# EAGLE design STM32L15x_Test (EAGLE 7.5.0)
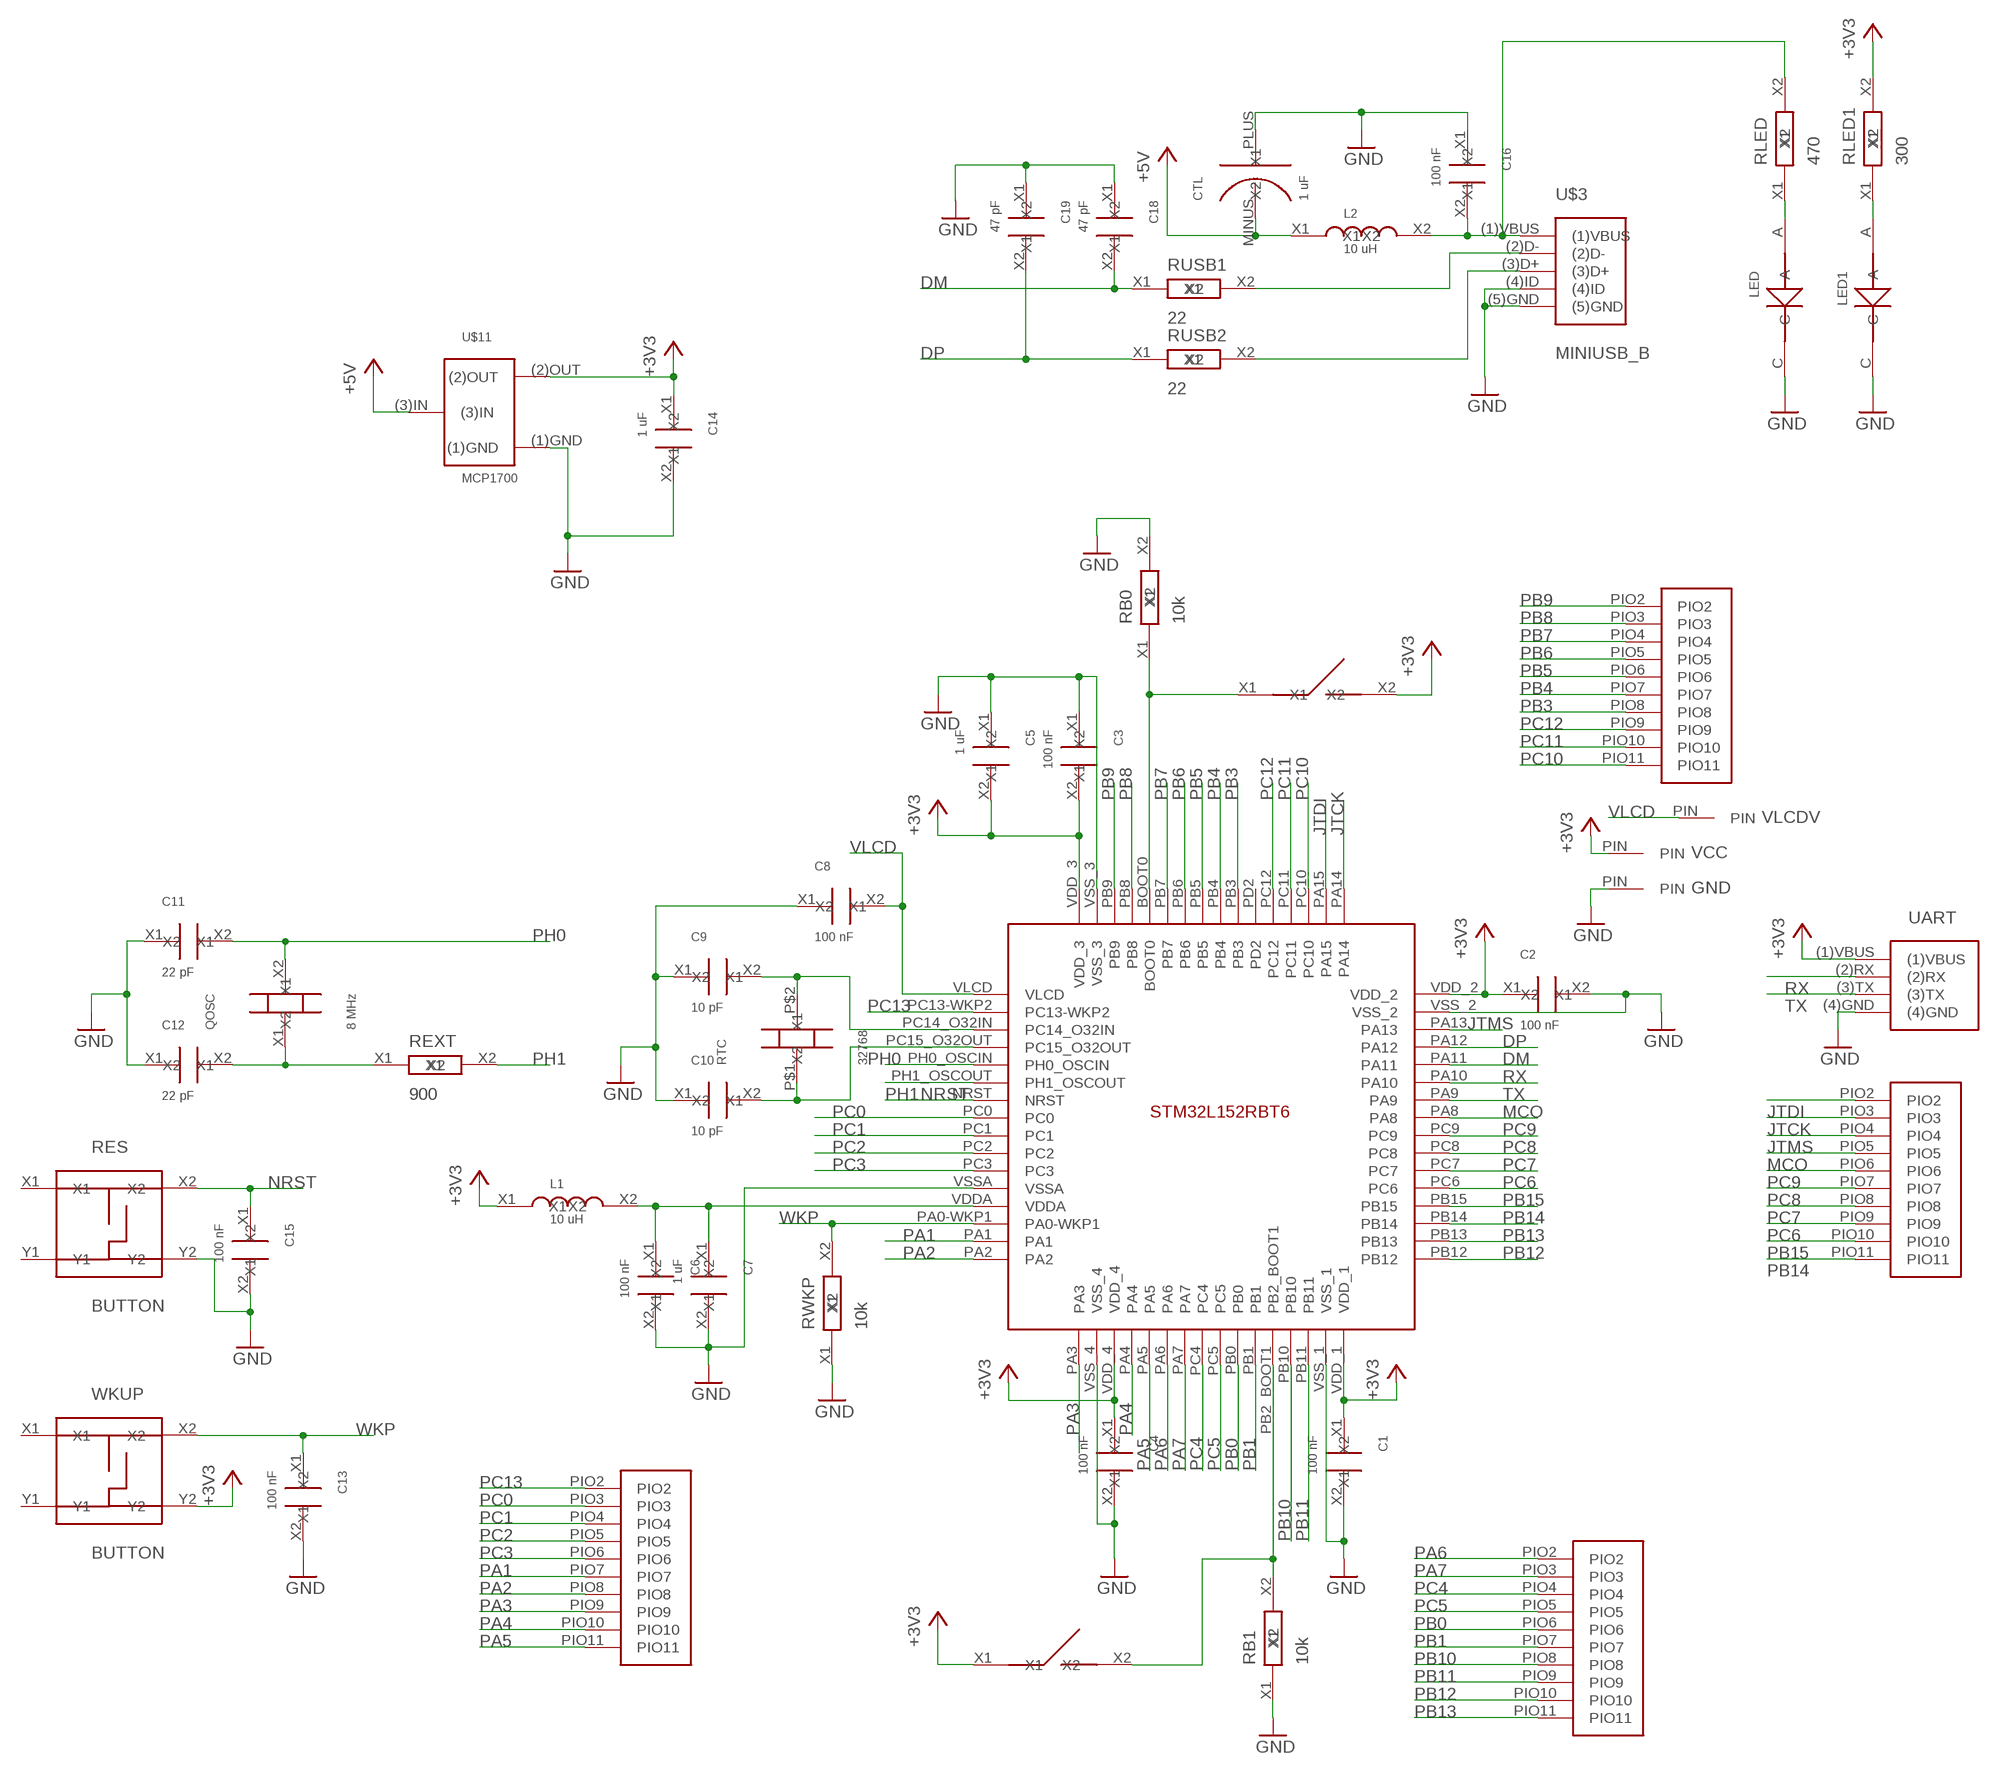
[diagram p0: schematic, sheet 1]

## Parts
C1  100 nF  C_SMD_2.1X1.25  [SMD_2.1X1.25]
C2  100 nF  C_SMD_2.1X1.25  [SMD_2.1X1.25]
C3  100 nF  C_SMD_2.1X1.25  [SMD_2.1X1.25]
C4  100 nF  C_SMD_2.1X1.25  [SMD_2.1X1.25]
C5  1 uF  C_SMD_2.1X1.25  [SMD_2.1X1.25]
C6  100 nF  C_SMD_2.1X1.25  [SMD_2.1X1.25]
C7  1 uF  C_SMD_2.1X1.25  [SMD_2.1X1.25]
C8  100 nF  C_SMD_2.1X1.25  [SMD_2.1X1.25]
C9  10 pF  C_SMD_2.1X1.25  [SMD_2.1X1.25]
C10  10 pF  C_SMD_2.1X1.25  [SMD_2.1X1.25]
C11  22 pF  C_SMD_2.1X1.25  [SMD_2.1X1.25]
C12  22 pF  C_SMD_2.1X1.25  [SMD_2.1X1.25]
C13  100 nF  C_SMD_2.1X1.25  [SMD_2.1X1.25]
C14  1 uF  C_SMD_2.1X1.25  [SMD_2.1X1.25]
C15  100 nF  C_SMD_2.1X1.25  [SMD_2.1X1.25]
C16  100 nF  C_SMD_2.1X1.25  [SMD_2.1X1.25]
C18  47 pF  C_SMD_2.1X1.25  [SMD_2.1X1.25]
C19  47 pF  C_SMD_2.1X1.25  [SMD_2.1X1.25]
CTL  1 uF  C_SMD_TA_A  [C_SMD_TA_A]
GND  PIN  [PIN]
L1  10 uH  L_SMD_2.1X1.25  [SMD_2.1X1.25]
L2  10 uH  L_SMD_2.1X1.25  [SMD_2.1X1.25]
LED  LED0805  [SMD0805]
LED1  LED0805  [SMD0805]
QOSC  8 MHz  QUARTZ_SMD  [QUARTZ_SMD]
RB0  10k  R_SMD_2.1X1.25  [SMD_2.1X1.25]
RB1  10k  R_SMD_2.1X1.25  [SMD_2.1X1.25]
RES  BUTTON  [BUTTON]
REXT  900  R_SMD_2.1X1.25  [SMD_2.1X1.25]
RLED  470  R_SMD_2.1X1.25  [SMD_2.1X1.25]
RLED1  300  R_SMD_2.1X1.25  [SMD_2.1X1.25]
RTC  32768  QUARTZ_CYL  [QUARTZ_CYL]
RUSB1  22  R_SMD_2.1X1.25  [SMD_2.1X1.25]
RUSB2  22  R_SMD_2.1X1.25  [SMD_2.1X1.25]
RWKP  10k  R_SMD_2.1X1.25  [SMD_2.1X1.25]
U$1  STM32L15XRBT6  [STM32L152RBT6]
U$2  PIO_10  [PIO_10]
U$3  MINIUSB_B  [MINIUSB_B]
U$5  PIO_10  [PIO_10]
U$6  PIO_10  [PIO_10]
U$7  PIO_10  [PIO_10]
U$8  DIP_1  [DIP_1]
U$9  DIP_1  [DIP_1]
U$11  MCP1700  [MCP1700]
UART  USART  [USART]
VCC  PIN  [PIN]
VLCDV  PIN  [PIN]
WKUP  BUTTON  [BUTTON]

## Nets
+3V3: C1.X1 C2.X1 C3.X2 C4.X1 C5.X2 C14.X1 L1.X1 RLED1.X2 U$1.VDD_1 U$1.VDD_2 U$1.VDD_3 U$1.VDD_4 U$8.X2 U$9.X1 U$11.(2)OUT UART.(1)VBUS VCC.PIN WKUP.Y2
+5V: CTL.MINUS(X1) L2.X1 U$11.(3)IN
BOOT0: RB0.X1 U$1.BOOT0 U$8.X1
BOOT1: RB1.X2 U$1.PB2_BOOT1 U$9.X2
DM: C18.X2 RUSB1.X1 U$1.PA11
DP: C19.X2 RUSB2.X1 U$1.PA12
GND: C1.X2 C2.X2 C3.X1 C4.X2 C5.X1 C6.X2 C7.X2 C8.X1 C9.X1 C10.X1 C11.X1 C12.X1 C13.X2 C14.X2 C15.X2 C16.X1 C18.X1 C19.X1 CTL.PLUS(X2) GND.PIN LED1.C LED.C RB0.X2 RB1.X1 RES.Y2 RWKP.X1 U$1.VSS_1 U$1.VSS_2 U$1.VSS_3 U$1.VSS_4 U$1.VSSA U$3.(4)ID U$3.(5)GND U$11.(1)GND UART.(4)GND
JTCK: U$1.PA14 U$6.PIO3
JTDI: U$1.PA15 U$6.PIO2
JTMS: U$1.PA13 U$6.PIO4
MCO: U$1.PA8 U$6.PIO5
N$1: C6.X1 C7.X1 L1.X2 U$1.VDDA
N$2: C9.X2 RTC.P$2(X2) U$1.PC14_O32IN
N$3: C10.X2 RTC.P$1(X1) U$1.PC15_O32OUT
N$6: C12.X2 QOSC.X1 REXT.X1
N$7: C16.X2 L2.X2 RLED.X2 U$3.(1)VBUS
N$8: RUSB1.X2 U$3.(2)D-
N$9: RUSB2.X2 U$3.(3)D+
N$10: LED.A RLED.X1
N$11: LED1.A RLED1.X1
NRST: C15.X1 RES.X2 U$1.NRST
PA1: U$1.PA1 U$2.PIO7
PA2: U$1.PA2 U$2.PIO8
PA3: U$1.PA3 U$2.PIO9
PA4: U$1.PA4 U$2.PIO10
PA5: U$1.PA5 U$2.PIO11
PA6: U$1.PA6 U$5.PIO2
PA7: U$1.PA7 U$5.PIO3
PB0: U$1.PB0 U$5.PIO6
PB1: U$1.PB1 U$5.PIO7
PB3: U$1.PB3 U$7.PIO8
PB4: U$1.PB4 U$7.PIO7
PB5: U$1.PB5 U$7.PIO6
PB6: U$1.PB6 U$7.PIO5
PB7: U$1.PB7 U$7.PIO4
PB8: U$1.PB8 U$7.PIO3
PB9: U$1.PB9 U$7.PIO2
PB10: U$1.PB10 U$5.PIO8
PB11: U$1.PB11 U$5.PIO9
PB12: U$1.PB12 U$5.PIO10
PB13: U$1.PB13 U$5.PIO11
PB14: U$1.PB14 U$6.PIO11
PB15: U$1.PB15 U$6.PIO10
PC0: U$1.PC0 U$2.PIO3
PC1: U$1.PC1 U$2.PIO4
PC2: U$1.PC2 U$2.PIO5
PC3: U$1.PC3 U$2.PIO6
PC4: U$1.PC4 U$5.PIO4
PC5: U$1.PC5 U$5.PIO5
PC6: U$1.PC6 U$6.PIO9
PC7: U$1.PC7 U$6.PIO8
PC8: U$1.PC8 U$6.PIO7
PC9: U$1.PC9 U$6.PIO6
PC10: U$1.PC10 U$7.PIO11
PC11: U$1.PC11 U$7.PIO10
PC12: U$1.PC12 U$7.PIO9
PC13: U$1.PC13-WKP2 U$2.PIO2
PH0: C11.X2 QOSC.X2 U$1.PH0_OSCIN
PH1: REXT.X2 U$1.PH1_OSCOUT
RX: U$1.PA10 UART.(2)RX
TX: U$1.PA9 UART.(3)TX
VLCD: C8.X2 U$1.VLCD VLCDV.PIN
WKP: C13.X1 RWKP.X2 U$1.PA0-WKP1 WKUP.X2
Unconnected: RES.X1 RES.Y1 U$1.PD2 WKUP.X1 WKUP.Y1

## Library data of the parts
C1-C16 C18 C19 = MyPowerComponents:C_SMD_2.1X1.25
CTL = MyAmSys:C_SMD_TA_A
GND VCC VLCDV = MySTM32F103RGT6:PIN
L1 L2 = MyPowerComponents:L_SMD_2.1X1.25
LED LED1 = My_BLE:LED0805
QOSC = MySTM32F103RGT6:QUARTZ_SMD
RB0 RB1 REXT RLED RLED1 RUSB1 RUSB2 RWKP = MyPowerComponents:R_SMD_2.1X1.25
RES WKUP = My_STM32:BUTTON
RTC = MySTM32F103RGT6:QUARTZ_CYL
U$1 = My_STM32L15x:STM32L15XRBT6
U$2 U$5-U$7 = My_BLE:PIO_10
U$3 = MyCMOSsensor:MINIUSB_B
U$8 U$9 = My_STM32L15x:DIP_1
U$11 = MyCMOSsensor:MCP1700
UART = MyCMOSsensor:USART

## Board
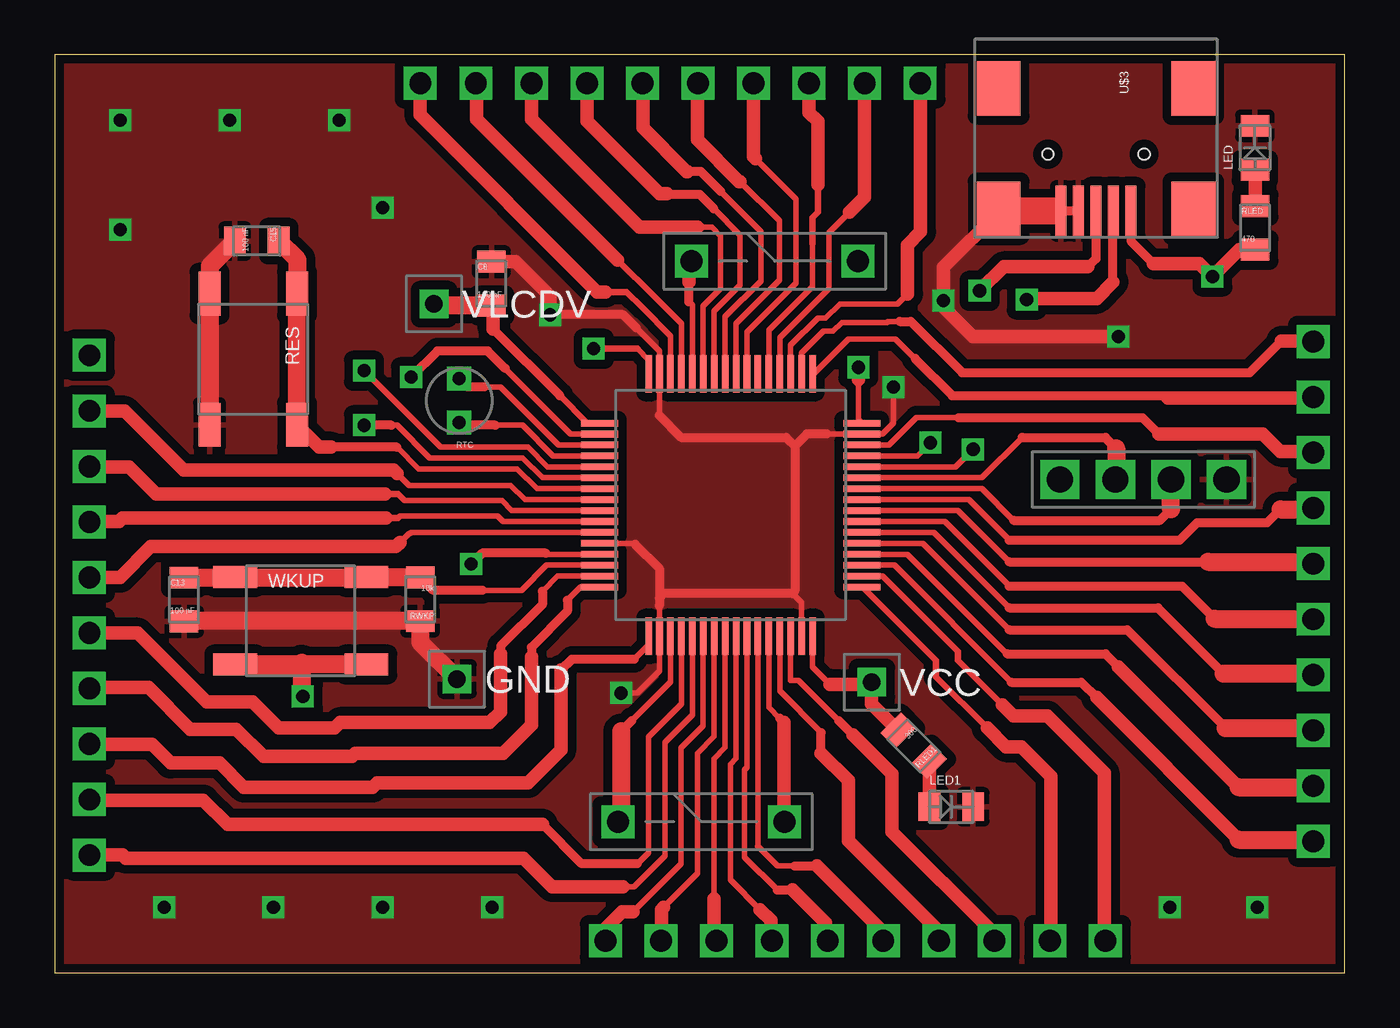
[diagram p1: board, top side]
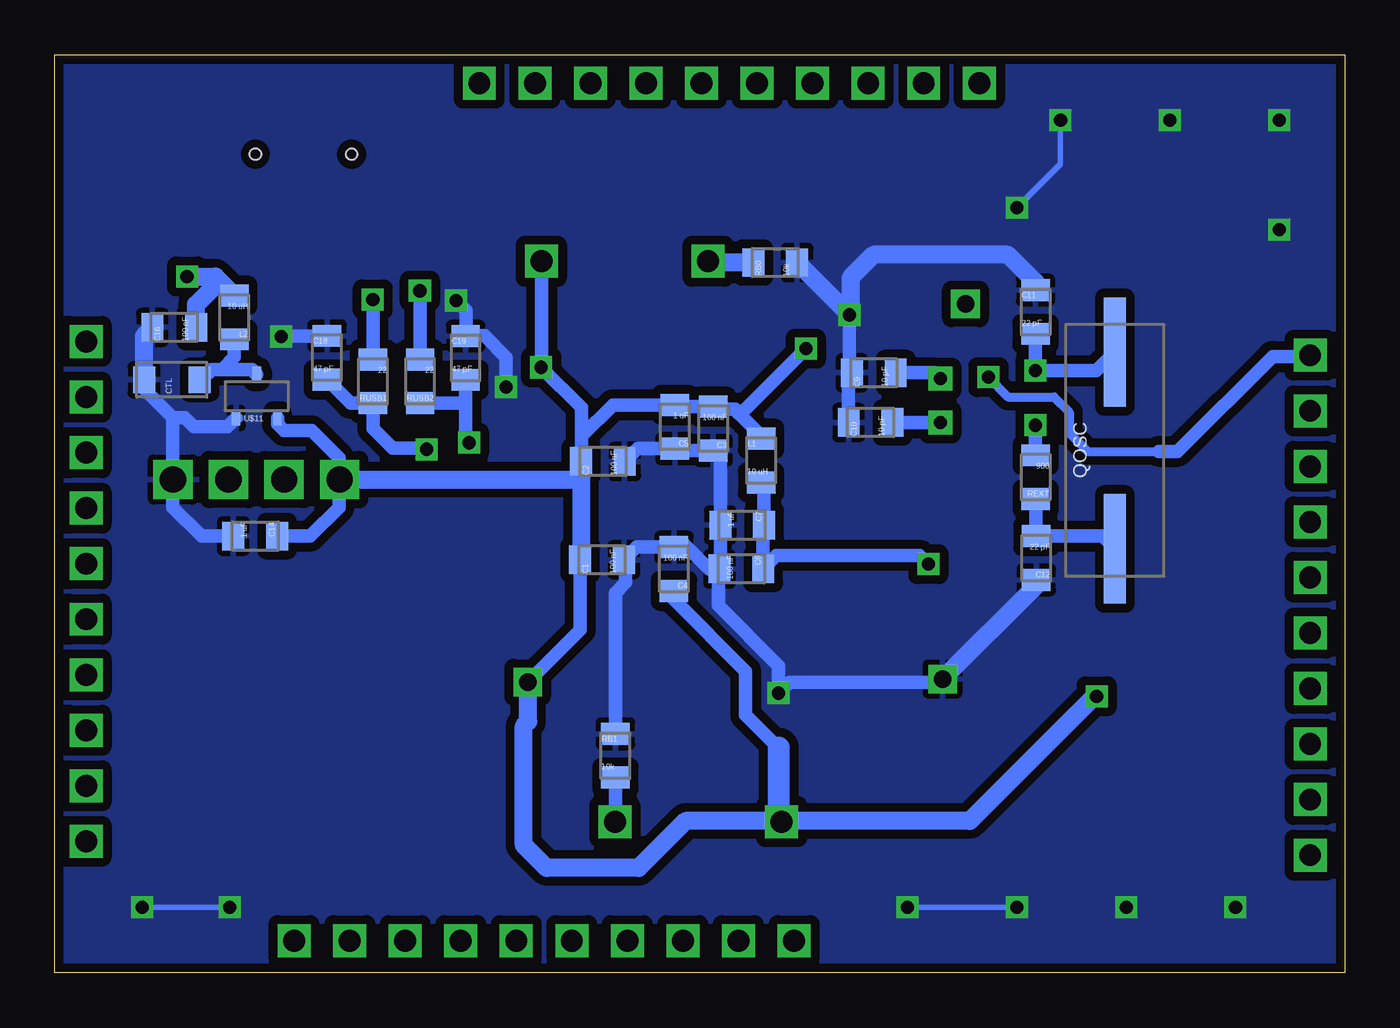
[diagram p2: board, bottom side, seen from below]

Size 59 x 42 mm. Coordinates in mm from the lower left corner, seen from the top.
Outline: 0,0 59,0 59,42 0,42 0,0
Copper layers (1*16): Top 0.035mm / dielectric 1.5mm / Bottom 0.035mm
Design rules "default *": minimum track width 10mil, minimum drill 24mil, track to track 8mil, track to pad 8mil, pad to pad 8mil, via to via 8mil, smd to smd 8mil, copper to edge 10mil, drill to drill 8mil, minimum pad ring 10mil, minimum via ring 8mil, stop-mask expansion 4mil, vias tented up to drill 0mil, thermal gap 10mil

### Footprints (pad centres in the part's own frame; a part is rotated, then mirrored left to right if it is on the bottom)
SMD_2.1X1.25 = smd 1.3 x 1: X1 0,1; X2 0,-1
C_SMD_TA_A = smd 1.2 x 1: MINUS 0,-1.27; PLUS 0,1.27
PIN = drill 0.8 square: PIN 0,0
SMD0805 = smd 1 x 1.3: A -1,0; C 1,0
QUARTZ_SMD = smd 5 x 1: X1 -4.5,0; X2 4.5,0
BUTTON = smd 2 x 1: X1 -3,2; X2 3,2; Y1 -3,-2; Y2 3,-2
QUARTZ_CYL = drill 0.6 square: P$1 0,1; P$2 0,-1
STM32L152RBT6 = smd 0.3 x 1.7: BOOT0 -1.75,6; PA3 -3.75,-6; PA4 -2.25,-6; PA5 -1.75,-6; PA6 -1.25,-6; PA7 -0.75,-6; PA14 3.75,6; PA15 3.25,6; PB0 0.75,-6; PB1 1.25,-6; PB2_BOOT1 1.75,-6; PB3 0.75,6; PB4 0.25,6; PB5 -0.25,6; PB6 -0.75,6; PB7 -1.25,6; PB8 -2.25,6; PB9 -2.75,6; PB10 2.25,-6; PB11 2.75,-6; PC4 -0.25,-6; PC5 0.25,-6; PC10 2.75,6; PC11 2.25,6; PC12 1.75,6; PD2 1.25,6; VDD_1 3.75,-6; VDD_3 -3.75,6; VDD_4 -2.75,-6; VSS_1 3.25,-6; VSS_3 -3.25,6; VSS_4 -3.25,-6 | smd 1.7 x 0.3: NRST -6,0.75; PA0-WKP1 -6,-2.75; PA1 -6,-3.25; PA2 -6,-3.75; PA8 6,0.25; PA9 6,0.75; PA10 6,1.25; PA11 6,1.75; PA12 6,2.25; PA13 6,2.75; PB12 6,-3.75; PB13 6,-3.25; PB14 6,-2.75; PB15 6,-2.25; PC0 -6,0.25; PC1 -6,-0.25; PC2 -6,-0.75; PC3 -6,-1.25; PC6 6,-1.75; PC7 6,-1.25; PC8 6,-0.75; PC9 6,-0.25; PC13-WKP2 -6,3.25; PC14_O32IN -6,2.75; PC15_O32OUT -6,2.25; PH0_OSCIN -6,1.75; PH1_OSCOUT -6,1.25; VDD_2 6,3.75; VDDA -6,-2.25; VLCD -6,3.75; VSS_2 6,3.25; VSSA -6,-1.75
PIO_10 = drill 1 square: PIO2 0,12.7; PIO3 0,10.16; PIO4 0,7.62; PIO5 0,5.08; PIO6 0,2.54; PIO7 0,0; PIO8 0,-2.54; PIO9 0,-5.08; PIO10 0,-7.62; PIO11 0,-10.16
MINIUSB_B = smd 2.3 x 0.5: (1)VBUS 0,1.6; (2)D- 0,0.8; (3)D+ 0,0; (4)ID 0,-0.8; (5)GND 0,-1.6 | smd 2.5 x 2: PG1 -0.1,-4.45; PG2 -5.6,-4.45; PG3 -5.6,4.45; PG4 -0.1,4.45 | hole 0.5: -2.6,2.2; -2.6,-2.2
DIP_1 = drill 1 square: X1 0,2.54; X2 0,-5.08
MCP1700 = smd 0.4 x 0.7: (1)GND -0.95,-2; (2)OUT 0.95,-2; (3)IN 0,0
USART = drill 1.2 square: (1)VBUS 0,5.08; (2)RX 0,2.54; (3)TX 0,0; (4)GND 0,-2.54

### Placement (x,y rotation side)
C1  33.97,18.9 90 bottom
C2  33.93,23.4 90 bottom
C3  28.89,24.9 180 bottom
C4  30.68,18.48 180 bottom
C5  30.64,24.98 180 bottom
C6  27.6,18.48 270 bottom
C7  27.56,20.48 270 bottom
C8  19.97,31.53 0 top
C9  21.54,27.45 90 bottom
C10  21.69,25.18 90 bottom
C11  14.15,30.23 0 bottom
C12  14.11,18.98 180 bottom
C13  5.92,17.08 0 top
C14  49.83,19.98 270 bottom
C15  9.24,33.48 270 top
C16  53.53,29.53 90 bottom
C18  46.55,28.14 0 bottom
C19  40.21,28.13 0 bottom
CTL  53.64,27.13 90 bottom
GND  18.4,13.44 0 top
L1  26.69,23.44 0 bottom
L2  50.79,29.98 180 bottom
LED  54.89,37.74 90 top
LED1  41,7.6 0 top
QOSC  10.52,23.9 90 bottom
RB0  26.05,32.49 90 bottom
RB1  33.36,9.94 0 bottom
RES  9.08,28.07 270 top
REXT  14.14,22.68 180 bottom
RLED  54.9,34.08 0 top
RLED1  39.29,10.39 225 top
RTC  18.5,26.18 180 top
RUSB1  44.44,27.06 180 bottom
RUSB2  42.29,27.06 180 bottom
RWKP  16.72,17.09 180 top
U$1  30.91,21.4 0 top
U$2  1.59,15.55 0 top
U$3  47.62,34.85 270 top
U$5  37.89,1.48 90 top
U$6  57.56,16.18 0 top
U$7  29.42,40.7 90 top
U$8  31.66,32.55 90 top
U$9  28.3,6.92 90 top
U$11  49.76,27.38 0 bottom
UART  51.05,22.57 90 top
VCC  37.37,13.3 0 top
VLCDV  17.35,30.6 0 top
WKUP  11.25,16.11 0 top

### Tracks (layer width: path | path; a pad name or v marks a point on that pad's centre or on a via)
+3V3  (via drill 0.6)
  Top 0.254: U$1.VDD_3 27.16,28.04 26.65,28.55 | U$1.VDD_4 28.16,13.31 26.4,11.55 | U$1.VDD_1 34.66,13.99 35.45,13.2 | 36.75,27.15 36.75,25.31 U$1.VDD_2
  Top 0.305: 26.65,28.55 v24.65,28.55
  Top 0.406: 26.4,11.55 25.9,11.05
  Top 0.61: 35.45,13.2 37.27,13.2 VCC.PIN 37.35,13.28 37.35,12.3 38.55,11.1 RLED1.X2 | v36.75,27.7 36.75,27.15
  Top 0.813: 25.9,11.05 25.9,7.06 U$9.X1 | WKUP.Y2 8.01,14.11 8,14.1 11.2,14.1 11.3,14.2 11.3,12.7 v11.35,12.65
  Bottom 0.254: 30.68,17.08 27.35,13.75 27.35,11.75 27.4,11.7 25.85,10.15 25.85,6.95
  Bottom 0.61: L1.X1 26.69,24.59 27.65,25.55 | 27.65,25.55 27.9,25.8 28.79,25.8 C3.X2 30.56,25.9 C5.X2 33.47,25.98 34.9,24.55 | v24.65,28.55 27.65,25.55 | 34.9,24.55 34.9,23.43 C2.X1 | C4.X1 30.68,17.08 27.4,13.8 27.4,11.8 25.9,10.3 | C1.X1 34.97,15.7 VCC.PIN | U$8.X2 v36.74,27.71 v36.75,27.7 34.9,25.85 34.9,24.55 | C14.X1 47.32,19.98 46,21.3 46,22.54 UART.(1)VBUS 46,22.6 46,23.55 47.25,24.8 48.5,24.8 48.81,25.11 U$11.(2)OUT
  Bottom 0.813: C2.X1 34.93,22.5 | 34.93,22.5 34.93,18.94 C1.X1 | UART.(1)VBUS 35,22.57 34.93,22.5 | v11.35,12.65 11.45,12.65 17.15,6.95 25.85,6.95 30.15,6.95 32.3,4.8 36.5,4.8 37.55,5.85 37.55,11.3 37.35,11.5 37.35,13.28 VCC.PIN
  Bottom 1.016: 25.9,10.3 25.9,7.06 U$9.X1
+5V
  Bottom 0.61: CTL.MINUS 52.27,27.13 51.8,27.6 51.35,27.6 | 51.35,27.6 49.98,27.6 U$11.(3)IN | L2.X1 50.79,28.16 51.35,27.6
BOOT0
  Top 0.254: U$1.BOOT0 29.16,30.54 29,30.7
  Top 0.406: 29,30.7 29,31.6
  Top 0.61: 29,31.6 29,32.43 U$8.X1
  Bottom 0.813: RB0.X1 29.06,32.49 U$8.X1
BOOT1
  Top 0.254: U$1.PB2_BOOT1 32.66,12.14 33.15,11.65
  Top 0.406: 33.15,11.65 33.35,11.45
  Top 0.61: 33.35,11.45 33.35,6.95 U$9.X2
  Top 1.016: 33.31,6.99 U$9.X2
  Bottom 0.61: RB1.X2 33.36,6.94 U$9.X2
DM  (via drill 0.6)
  Top 0.254: U$1.PA11 41.2,23.15 v42,23.95
  Bottom 0.254: v42,23.95 42,24
  Bottom 0.61: v42,23.95 42.05,24 43.55,24 44.44,24.89 RUSB1.X1 45.47,26.06 C18.X2
DP  (via drill 0.6)
  Top 0.254: U$1.PA12 39.45,23.65 v40.05,24.25
  Bottom 0.254: v40.05,24.25 40.05,24.3
  Bottom 0.61: C19.X2 40.21,26.06 RUSB2.X1 40.2,26.06 40.2,24.4 v40.05,24.25
GND  (via drill 0.6)
  Top 0.254: v25.9,12.8 26.65,12.8 27.66,13.81 U$1.VSS_4 27.65,16.8 | U$1.VSSA 26.5,19.65 26.55,19.6 | U$1.VSS_1 34.16,16.94 33.75,17.35 | 35.3,24.65 U$1.VSS_2 37.85,24.65 38.35,25.15 v38.35,26.8 | 27.65,25.5 27.66,25.51 U$1.VSS_3 27.66,28.44 26.6,29.5
  Top 0.406: 26.55,19.6 27.65,18.5 27.65,17.15 | 27.65,17.15 27.65,16.8 | 27.65,17.15 27.85,17.35 33.75,17.35 33.85,17.45 33.85,24.1 | 35.3,24.65 34.4,24.65 33.85,24.1 | 27.65,25.5 28.65,24.5 33.45,24.5 33.85,24.1 | 26.6,29.5 26,30.1 v22.65,30.1 | U$3.(4)ID U$3.(5)GND
  Top 0.61: C8.X1 21.07,32.53 22.65,30.95 v22.65,30.1 | v48.65,29.1 42,29.1 40.65,30.45 v40.65,30.75 40.65,32.28 43.22,34.85
  Top 0.813: C13.X2 RWKP.X1 16.72,15.12 GND.PIN | RES.Y2 7.1,25.07 7.1,32.34 C15.X2
  Bottom 0.254: v51,3 v55,3 | v15,3 v20,3 | v13,39 13,37 v15,35
  Bottom 0.61: C10.X1 22.69,27.3 C9.X1 22.65,27.56 v22.65,30.1 | C2.X2 32.35,23.98 C5.X1 30.56,23.9 C3.X1 28.56,23.57 C7.X2 28.56,18.52 C6.X2 | C6.X2 29.08,18.48 30.15,19.55 30.61,19.55 C4.X2 32.39,19.48 C1.X2 32.9,18.83 32.9,17.85 33.36,17.39 RB1.X1 | C6.X2 28.65,18.43 28.65,16.8 25.9,14.05 v25.9,12.8 25.4,13.3 18.55,13.3 GND.PIN | C14.X2 52.28,19.98 53.6,21.3 UART.(4)GND 53.6,25.4 | CTL.PLUS 54.91,26.71 53.6,25.4 | 53.6,25.4 53.05,25.4 52.65,25 51.09,25 U$11.(1)GND | v38.35,26.8 38.35,28.15 39.35,29.15 40.19,29.15 | 40.19,29.15 C19.X1 | C18.X1 48.61,29.14 v48.65,29.1 | 40.19,29.15 40.19,30.29 v40.65,30.75
  Bottom 0.813: C12.X1 14.11,17.73 GND.PIN | RB0.X2 v22.65,30.1 22.6,30.15 22.6,31.8 21.55,32.85 15.4,32.85 14.15,31.6 C11.X1 | CTL.PLUS 54.91,29.15 C16.X1
  other vias: 5,3 10,3 3,34 3,39 8,39
  pour Top (isolate 0.406): 0,0 0,42 59,42 59,0
  pour Bottom (isolate 0.406): 0,0 59,0 59,42 0,42
JTCK
  Top 0.254: U$1.PA14 34.7,27.4 36.3,29 38.45,29 39.35,28.1
  Top 0.406: 39.35,28.1 41.05,26.4 50.8,26.4 50.9,26.3
  Top 0.61: 50.9,26.3 57.52,26.3 U$6.PIO3
JTDI
  Top 0.254: U$1.PA15 34.16,28.36 35.15,29.35 35.6,29.35 36,29.75 38.05,29.75 38.1,29.8 38.65,29.8
  Top 0.406: 38.65,29.8 39.15,29.8 41.5,27.45 54.65,27.45 56.1,28.9
  Top 0.61: 56.1,28.9 57.54,28.9 U$6.PIO2
JTMS
  Top 0.254: U$1.PA13 38.15,24.15 39.4,25.4 41.35,25.4
  Top 0.406: 41.35,25.4 49.75,25.4 50.5,24.65
  Top 0.61: 50.5,24.65 55.25,24.65 56.05,23.85 57.51,23.85 U$6.PIO4
MCO
  Top 0.254: U$1.PA8 41.8,21.65 43.65,19.8
  Top 0.406: 43.65,19.8 51.45,19.8 52.25,20.6 55.45,20.6 56.05,21.2
  Top 0.813: 56.05,21.2 57.5,21.2 U$6.PIO5
N$1  (via drill 0.6)
  Top 0.254: 19.5,19.15 19.4,19.05 v19.05,18.7 | U$1.VDDA 22.5,19.15 22.45,19.2
  Top 0.406: 22.45,19.2 19.55,19.2 19.4,19.05
  Bottom 0.61: L1.X2 26.56,22.31 C7.X1 26.6,20.44 C6.X1 25.98,19.1 19.45,19.1 v19.05,18.7
N$2
  Top 0.254: U$1.PC14_O32IN 23.05,24.15 20.4,26.8 19.65,26.8
  Top 0.406: 19.65,26.8 18.88,26.8 RTC.P$2
  Bottom 0.61: C9.X2 18.77,27.45 RTC.P$2
N$3
  Top 0.254: U$1.PC15_O32OUT 22.8,23.65 21.4,25.05 20.15,25.05
  Top 0.406: 20.15,25.05 18.63,25.05 RTC.P$1
  Bottom 0.61: C10.X2 RTC.P$1
N$6
  Bottom 0.61: REXT.X1 14.14,20.01 C12.X2 11.1,19.98 QOSC.X1
N$7  (via drill 0.6)
  Top 0.406: U$3.(1)VBUS 49.22,33.48 50.25,32.45
  Top 0.61: 50.25,32.45 52.35,32.45 v52.95,31.85 54.18,33.08 RLED.X2
  Bottom 0.813: v52.95,31.85 51.66,31.85 51.45,31.64 | 51.45,31.64 L2.X2 | C16.X2 52.53,30.57 51.45,31.64
N$8  (via drill 0.6)
  Top 0.406: 48.4,31.6 48.4,34.83 U$3.(2)D-
  Top 0.61: v44.45,30.8 44.45,30.85 47.65,30.85 48.4,31.6
  Bottom 0.61: RUSB1.X2 v44.44,30.79 v44.45,30.8
N$9  (via drill 0.6)
  Top 0.406: U$3.(3)D+ 47.62,32.67 47.25,32.3
  Top 0.61: 42.3,31.35 v42.3,31.2 43.4,32.3 47.25,32.3
  Bottom 0.61: RUSB2.X2 v42.29,31.19 v42.3,31.2
N$10
  Top 0.61: RLED.X1 LED.A
N$11
  Top 0.61: RLED1.X1 LED1.A
NRST
  Top 0.254: U$1.NRST 22.05,22.15 21.15,23.05 16.65,23.05 15.65,24.05
  Top 0.406: 15.65,24.05 12.65,24.05
  Top 0.61: 12.65,24.05 12.1,24.05 RES.X2
  Top 0.813: RES.X2 11.08,31.53 11.1,31.55 11.1,32.62 C15.X1
PA1
  Top 0.254: U$1.PA1 23,18.15 22.3,17.45
  Top 0.406: 22.3,17.45 22.3,16.85 20.4,14.95 20.4,14.6
  Top 0.61: 20.4,14.6 20.4,11.95 19.9,11.45 13.05,11.45 12.8,11.2 10.25,11.2 9.05,12.4 6.95,12.4 3.8,15.55 U$2.PIO7
PA2
  Top 0.254: U$1.PA2 24.05,17.65 23.45,17.05
  Top 0.406: 23.45,17.05 23.45,16.55 21.8,14.9 21.8,14.45
  Top 0.61: 21.8,14.45 21.8,11.35 20.5,10.05 13.75,10.05 13.6,9.9 9.55,9.9 8.3,11.15 6.2,11.15 4.3,13.05 1.63,13.05 U$2.PIO8
PA3
  Top 0.254: U$1.PA3 27.16,15.01 26.5,14.35
  Top 0.406: 26.5,14.35 23.65,14.35 23.15,13.85
  Top 0.61: 23.15,13.85 23.15,10.2 21.65,8.7 14.75,8.7 14.55,8.5 8.65,8.5 7.55,9.6 5.3,9.6 4.45,10.45 1.61,10.45 U$2.PIO9
PA4
  Top 0.254: U$1.PA4 28.66,12.31 27.15,10.8 27.15,5.5 26.65,5
  Top 0.406: 26.65,5 24.1,5 22.3,6.8
  Top 0.61: 22.3,6.8 7.9,6.8 6.8,7.9 1.62,7.9 U$2.PIO10
PA5
  Top 0.254: U$1.PA5 29.16,11.81 27.9,10.55 27.9,5.35 26.5,3.95 26,3.95
  Top 0.61: 26,3.95 22.75,3.95 21.45,5.25 3.25,5.25 3.1,5.4 U$2.PIO11
PA6
  Top 0.254: U$1.PA6 29.66,11.31 28.65,10.3 28.65,5 26.45,2.8
  Top 0.61: 26.45,2.8 25.95,2.8 25.2,2.05 U$5.PIO2
PA7
  Top 0.254: U$1.PA7 30.16,10.81 29.4,10.05 29.4,4.55 27.85,3
  Top 0.61: 27.85,3 27.75,2.9 27.75,1.5 U$5.PIO3
PB0
  Top 0.254: U$1.PB0 31.66,9.41 31.55,9.3 31.55,5.3 33.05,3.8
  Top 0.406: 33.05,3.8 33.75,3.8
  Top 0.61: 33.75,3.8 35.25,2.3 35.25,1.58 U$5.PIO6
PB1
  Top 0.254: U$1.PB1 32.16,5.81 | 32.16,5.81 32.15,5.8 | 32.16,5.81 32.16,5.79 33.05,4.9 33.85,4.9
  Top 0.406: 33.85,4.9 34.85,4.9
  Top 0.61: 34.85,4.9 37.85,1.9 37.85,1.52 U$5.PIO7
PB3
  Top 0.254: U$1.PB3 31.66,29.31 33.9,31.55 33.9,35.4 32.05,37.25
  Top 0.61: U$7.PIO8 31.96,37.34 32.05,37.25
PB4
  Top 0.254: U$1.PB4 31.16,29.71 33.15,31.7 33.15,34.4 31.35,36.2
  Top 0.61: 31.35,36.2 31.3,36.2 29.4,38.1 29.4,40.68 U$7.PIO7
PB5
  Top 0.254: U$1.PB5 30.66,30.01 32.3,31.65 32.3,33.9 30.45,35.75
  Top 0.406: 30.45,35.75 29.55,36.65 28.95,36.65
  Top 0.61: 28.95,36.65 28.9,36.65 26.9,38.65 26.9,40.68 U$7.PIO6
PB6
  Top 0.254: U$1.PB6 30.16,30.26 31.35,31.45 31.35,33.75 30.15,34.95
  Top 0.406: 30.15,34.95 29.5,35.6 28.05,35.6 28,35.65
  Top 0.61: 28,35.65 27.65,35.65 24.35,38.95 U$7.PIO5
PB7
  Top 0.254: U$1.PB7 29.66,30.51 30.45,31.3 30.45,33.7 30.05,34.1 29.4,34.1
  Top 0.61: 29.4,34.1 26.75,34.1 21.8,39.05 U$7.PIO4
PB8
  Top 0.254: U$1.PB8 28.66,29.69 27.4,30.95
  Top 0.305: 27.4,30.95 25.75,32.6
  Top 0.61: 25.75,32.6 19.3,39.05 19.3,40.66 U$7.PIO3
PB9
  Top 0.254: U$1.PB9 28.16,29.14 26.85,30.45
  Top 0.305: 26.85,30.45 26.15,31.15 25.2,31.15
  Top 0.61: 25.2,31.15 24.8,31.15 16.7,39.25 16.7,40.68 U$7.PIO2
PB10
  Top 0.254: U$1.PB10 33.16,12.89 35.05,11
  Top 0.406: 35.05,10.05 35.05,11
  Top 0.61: U$5.PIO8 40.35,1.56 40.35,2 36.3,6.05 36.3,8.8 35.05,10.05
PB11
  Top 0.254: U$1.PB11 33.66,13.39 34.01,13.39 35.85,11.55
  Top 0.406: 35.85,11.55 36.5,10.9
  Top 0.61: U$5.PIO9 42.85,1.6 42.85,1.9 38.3,6.45 38.3,9.1 36.5,10.9
PB12
  Top 0.254: U$1.PB12 36.95,17.65 40.3,14.3
  Top 0.305: 40.3,14.3 40.3,13.55 42.65,11.2
  Top 0.61: 42.65,11.2 43.5,10.35 44.2,10.35 45.55,9 45.55,1.52 U$5.PIO10
PB13
  Top 0.254: U$1.PB13 37.85,18.15 41.3,14.7
  Top 0.305: 41.3,14.7 41.3,14.3 43.35,12.25
  Top 0.61: 43.35,12.25 43.85,11.75 45.4,11.75 48,9.15 48,1.53 U$5.PIO11
PB14
  Top 0.254: U$1.PB14 38.4,18.65 43.75,13.3
  Top 0.406: 43.75,13.3 46.95,13.3 47.65,12.6
  Top 0.61: 47.65,12.6 54.15,6.1
  Top 0.813: 54.15,6.1 57.48,6.1 U$6.PIO11
PB15
  Top 0.254: U$1.PB15 39,19.15 43.55,14.6
  Top 0.406: 43.55,14.6 48.05,14.6 48.65,14
  Top 0.61: 48.65,14 54.15,8.5
  Top 0.813: 54.15,8.5 57.5,8.5 U$6.PIO10
PC0
  Top 0.254: U$1.PC0 21.5,21.65 20.85,22.3 16.2,22.3 15.65,22.85
  Top 0.61: 15.65,22.85 15.5,23 5.9,23 3.2,25.7 U$2.PIO3
PC1
  Top 0.254: U$1.PC1 20.9,21.15 20.45,21.6 16,21.6 15.7,21.9
  Top 0.305: 15.7,21.9 15.1,21.9
  Top 0.61: 15.1,21.9 4.65,21.9 3.4,23.15 1.61,23.15 U$2.PIO4
PC2
  Top 0.254: U$1.PC2 20.5,20.65 20.25,20.9 15.8,20.9 15.7,20.8
  Top 0.305: 15.7,20.8 15.15,20.8
  Top 0.61: 15.15,20.8 3.1,20.8 2.95,20.65 1.61,20.65 U$2.PIO5
PC3
  Top 0.254: U$1.PC3 16.3,20.15 16.25,20.1 16.2,20.1 15.8,19.7
  Top 0.61: 15.8,19.7 15.6,19.5 4.4,19.5 3,18.1 U$2.PIO6
PC4
  Top 0.254: U$1.PC4 30.66,10.31 30.15,9.8 30.15,3.4
  Top 0.61: 30.15,3.4 30.15,1.6 U$5.PIO4
PC5
  Top 0.254: U$1.PC5 31.16,9.81 30.9,9.55 30.9,4.25 32.25,2.9
  Top 0.61: 32.25,2.9 32.75,2.4 32.75,1.54 U$5.PIO5
PC6
  Top 0.254: U$1.PC6 39.7,19.65 43.65,15.7
  Top 0.406: 43.65,15.7 49.05,15.7 53.55,11.2
  Top 0.813: 53.55,11.2 57.46,11.2 U$6.PIO9
PC7
  Top 0.254: U$1.PC7 40.2,20.15 43.65,16.7
  Top 0.406: 43.65,16.7 50.45,16.7 53.45,13.7
  Top 0.813: 53.45,13.7 57.5,13.7 U$6.PIO8
PC8
  Top 0.254: U$1.PC8 40.7,20.65 43.65,17.7
  Top 0.406: 43.65,17.7 51.55,17.7 53.05,16.2
  Top 0.813: 53.05,16.2 57.54,16.2 U$6.PIO7
PC9
  Top 0.254: U$1.PC9 41.3,21.15 43.65,18.8
  Top 0.406: 43.65,18.8 52.75,18.8
  Top 0.813: 52.75,18.8 57.48,18.8 U$6.PIO6
PC10
  Top 0.254: U$1.PC10 33.66,28.71 34.9,29.95 35.25,29.95 35.9,30.6 38.55,30.6 39,31.05
  Top 0.61: 39,31.05 39,33.3 39.6,33.9 39.6,40.68 U$7.PIO11
PC11
  Top 0.254: U$1.PC11 33.16,29.06 35.4,31.3 35.4,33.85 36.35,34.8
  Top 0.61: U$7.PIO10 37.04,35.49 36.35,34.8
PC12
  Top 0.254: U$1.PC12 32.66,29.41 34.65,31.4 34.65,33.35
  Top 0.305: 34.65,33.35 34.65,34.55 34.9,34.8 34.9,36.05
  Top 0.61: 34.9,36.05 34.9,38.95 34.5,39.35 U$7.PIO9
PC13  (via drill 0.6)
  Top 0.254: U$1.PC13-WKP2 23.6,24.65 20.6,27.65
  Top 0.406: 20.6,27.65 19.8,28.45 17.5,28.45 v16.3,27.25
  Bottom 0.406: v16.3,27.25 15.4,26.35 13.3,26.35 12.6,25.65 12.6,24.7 11.75,23.85 8.5,23.85
  Bottom 0.61: 8.5,23.85 7.65,23.85 3.3,28.2 1.64,28.2 U$2.PIO2
PH0  (via drill 0.6)
  Top 0.254: U$1.PH0_OSCIN 22.55,23.15 21.65,24.05 17.65,24.05 v14.15,27.55
  Bottom 0.61: QOSC.X2 11.37,27.55 v14.15,27.55 C11.X2
PH1  (via drill 0.6)
  Top 0.254: U$1.PH1_OSCOUT 22.3,22.65 21.4,23.55 17.15,23.55 15.65,25.05 15.4,25.05
  Top 0.406: 15.4,25.05 v14.15,25.05
  Bottom 0.61: v14.15,25.05 REXT.X2
RX
  Top 0.254: U$1.PA10 42.4,22.65 44.25,24.5
  Top 0.406: 44.25,24.5 48.05,24.5 48.55,24
  Top 0.813: 48.55,24 48.55,22.61 UART.(2)RX
TX
  Top 0.254: U$1.PA9 42.4,22.15 43.85,20.7
  Top 0.406: 43.85,20.7 50.55,20.7 51.05,21.2
  Top 0.813: 51.05,21.2 UART.(3)TX
VLCD
  Top 0.254: U$1.VLCD 24.35,25.15 23.1,26.4
  Top 0.406: 23.1,26.4 20.05,29.45
  Top 0.61: 20.05,29.45 20.05,30.45 C8.X2
  Top 0.813: C8.X2 17.42,30.53 VLCDV.PIN
WKP
  Top 0.254: U$1.PA0-WKP1 22.5,18.65 21.35,17.5 19.55,17.5
  Top 0.406: 19.55,17.5 17.31,17.5 RWKP.X2
  Top 0.813: RWKP.X2 14.27,18.09 WKUP.X2 14.22,18.08 C13.X1